# Altium schematic sheet communication.SchDoc
size A3
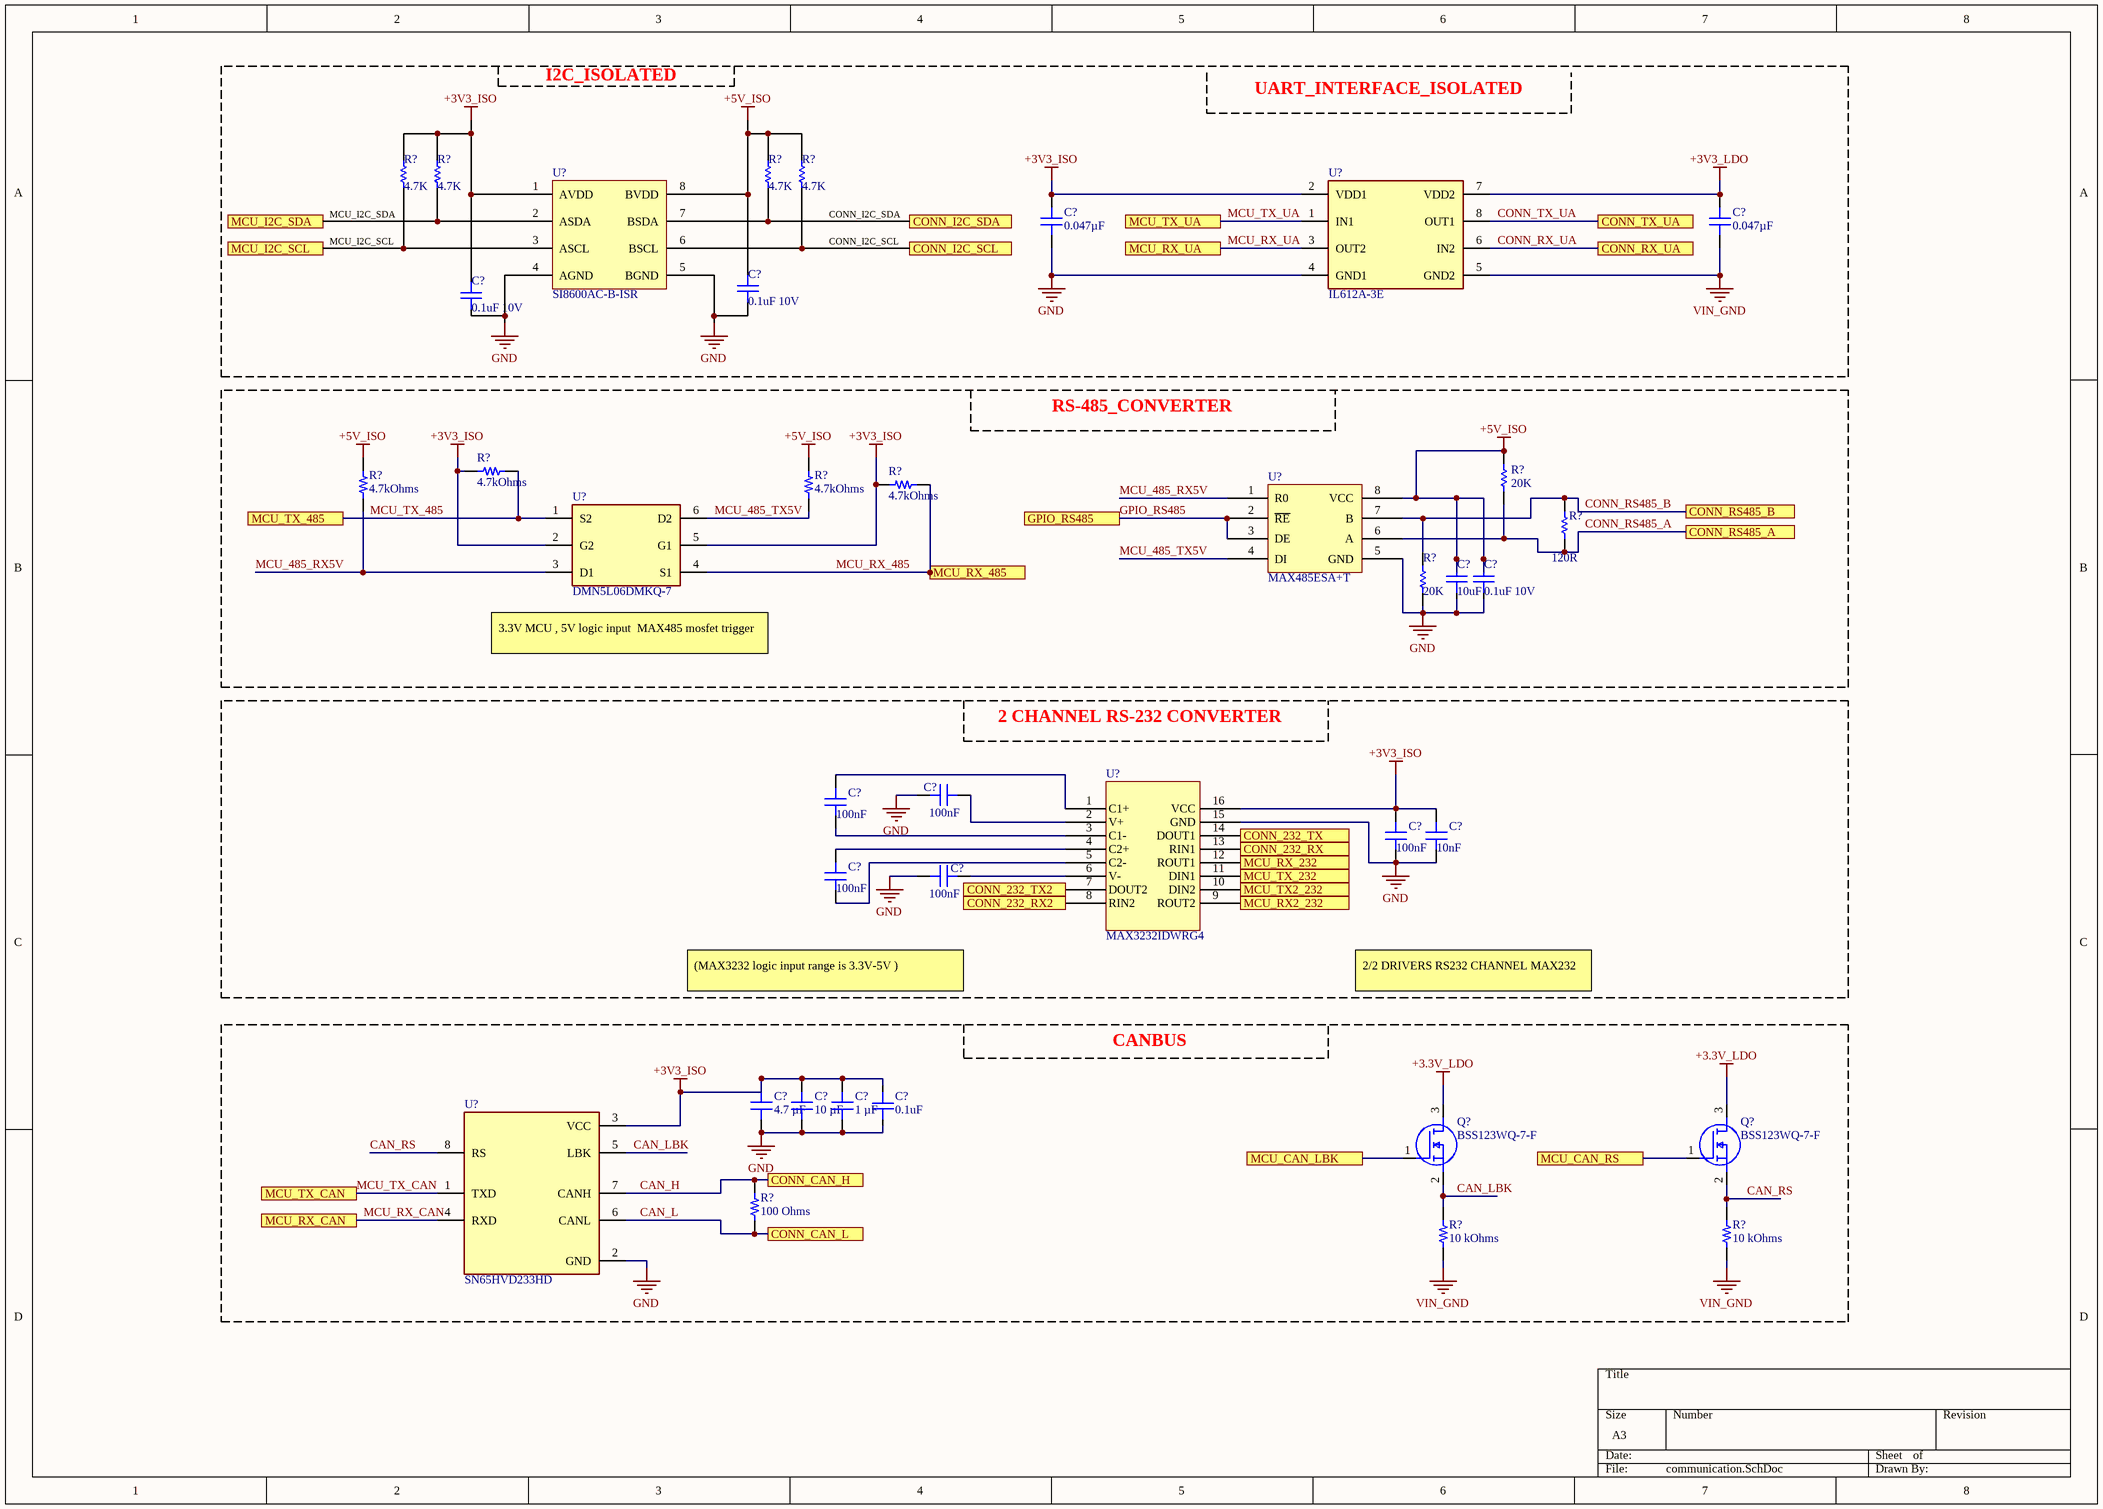
[diagram p0: communication.SchDoc]

## Parts
(Parts that share a designator on the sheet are numbered #1, #2 ... from top to bottom, then left to right.)
C?#1  0.047µF  [CAP 0603_1608]
C?#2  0.047µF  [CAP 0603_1608]
C?#3  0.1uF 10V  [C0603]
C?#4  0.1uF 10V  [C0603]
C?#5  10uF  [C1210]
C?#6  0.1uF 10V  [C0603]
C?#7  100nF  [CAP-0603]
C?#8  100nF  [CAP-0603]
C?#9  100nF  [CAP-0603]
C?#10  100nF  [CAP-0603]
C?#11  10nF  [CAP-0603]
C?#12  100nF  [CAP-0603]
C?#13  0.1uF  [C0603]
C?#14  4.7 µF  [CAP 0603_1608]
C?#15  10 µF  [CAP 0603_1608]
C?#16  1 µF  [CAP 0603_1608]
Q?#1  BSS123WQ-7-F  [SOT65P210X110-3N]
Q?#2  BSS123WQ-7-F  [SOT65P210X110-3N]
R?#1  4.7K  [R0805]
R?#2  4.7K  [R0805]
R?#3  4.7K  [R0805]
R?#4  4.7K  [R0805]
R?#5  4.7kOhms  [RES-0603]
R?#6  4.7kOhms  [RES-0603]
R?#7  20K  [R0805]
R?#8  4.7kOhms  [RES-0603]
R?#9  4.7kOhms  [RES-0603]
R?#10  120R  [R0805]
R?#11  20K  [R0805]
R?#12  100 Ohms  [RES 0603_1608]
R?#13  10 kOhms  [RES 0603_1608]
R?#14  10 kOhms  [RES 0603_1608]
U?#1  SI8600AC-B-ISR  [SOIC127P600X175-8N]
U?#2  IL612A-3E  [8-soic]
U?#3  MAX485ESA+T  [SOIC127P600X175-8N]
U?#4  DMN5L06DMKQ-7  [SOT-26]
U?#5  MAX3232IDWRG4  [SOIC-16]
U?#6  SN65HVD233HD  [8-soic]

## Blocks framed on the sheet
RS-485_CONVERTER: C?#5 C?#6 R?#5-R?#11 U?#3 U?#4
2 CHANNEL RS-232 CONVERTER: C?#7-C?#12 U?#5
CANBUS: C?#13-C?#16 Q?#1 Q?#2 R?#12-R?#14 U?#6

## Ports
CONN_232_RX, CONN_232_RX2, CONN_232_TX, CONN_232_TX2, CONN_CAN_H, CONN_CAN_L, CONN_I2C_SCL, CONN_I2C_SDA, CONN_RS485_A, CONN_RS485_B, CONN_RX_UA, CONN_TX_UA, GPIO_RS485, MCU_CAN_LBK, MCU_CAN_RS, MCU_I2C_SCL, MCU_I2C_SDA, MCU_RX2_232, MCU_RX_232, MCU_RX_485, MCU_RX_CAN, MCU_RX_UA, MCU_TX2_232, MCU_TX_232, MCU_TX_485, MCU_TX_CAN, MCU_TX_UA

## Nets
+3.3V_LDO: Q?#1.3(D) Q?#2.3(D)
+3V3_ISO: C?#1.2 C?#4.2 C?#10.2 C?#11.2 C?#13.1 C?#14.2 C?#15.2 C?#16.2 R?#1.2 R?#2.2 R?#5.2 R?#6.1 U?#1.1(AVDD) U?#2.2(VDD1) U?#4.2(G2) U?#4.5(G1) U?#5.16(VCC) U?#6.3(VCC)
+3V3_LDO: C?#2.2 U?#2.7(VDD2)
+5V_ISO: C?#3.2 C?#5.2 C?#6.2 R?#3.2 R?#4.2 R?#7.2 R?#8.2 R?#9.2 U?#1.8(BVDD) U?#3.8(VCC)
GND: C?#1.1 C?#3.1 C?#4.1 C?#5.1 C?#6.1 C?#8.2 C?#10.1 C?#11.1 C?#12.2 C?#13.2 C?#14.1 C?#15.1 C?#16.1 R?#11.1 U?#1.4(AGND) U?#1.5(BGND) U?#2.4(GND1) U?#3.5(GND) U?#5.15(GND) U?#6.2(GND)
VIN_GND: C?#2.1 R?#13.1 R?#14.1 U?#2.5(GND2)
CAN_H: R?#12.2 U?#6.7(CANH) ; port CONN_CAN_H
CAN_L: R?#12.1 U?#6.6(CANL) ; port CONN_CAN_L
CAN_LBK: Q?#1.2(S) R?#13.2 U?#6.5(LBK)
CAN_RS: Q?#2.2(S) R?#14.2 U?#6.8(RS)
CONN_232_RX: U?#5.13(RIN1) ; port CONN_232_RX
CONN_232_RX2: U?#5.8(RIN2) ; port CONN_232_RX2
CONN_232_TX: U?#5.14(DOUT1) ; port CONN_232_TX
CONN_232_TX2: U?#5.7(DOUT2) ; port CONN_232_TX2
CONN_I2C_SCL: R?#4.1 U?#1.6(BSCL) ; port CONN_I2C_SCL
CONN_I2C_SDA: R?#3.1 U?#1.7(BSDA) ; port CONN_I2C_SDA
CONN_RS485_A: R?#7.1 R?#10.1 U?#3.6(A) ; port CONN_RS485_A
CONN_RS485_B: R?#10.2 R?#11.2 U?#3.7(B) ; port CONN_RS485_B
CONN_RX_UA: U?#2.6(IN2) ; port CONN_RX_UA
CONN_TX_UA: U?#2.8(OUT1) ; port CONN_TX_UA
GPIO_RS485: U?#3.2(~{RE}) U?#3.3(DE) ; port GPIO_RS485
MCU_485_RX5V: R?#8.1 U?#3.1(R0) U?#4.3(D1)
MCU_485_TX5V: R?#9.1 U?#3.4(DI) U?#4.6(D2)
MCU_CAN_LBK: Q?#1.1(G) ; port MCU_CAN_LBK
MCU_CAN_RS: Q?#2.1(G) ; port MCU_CAN_RS
MCU_I2C_SCL: R?#1.1 U?#1.3(ASCL) ; port MCU_I2C_SCL
MCU_I2C_SDA: R?#2.1 U?#1.2(ASDA) ; port MCU_I2C_SDA
MCU_RX2_232: U?#5.9(ROUT2) ; port MCU_RX2_232
MCU_RX_232: U?#5.12(ROUT1) ; port MCU_RX_232
MCU_RX_485: R?#6.2 U?#4.4(S1) ; port MCU_RX_485
MCU_RX_CAN: U?#6.4(RXD) ; port MCU_RX_CAN
MCU_RX_UA: U?#2.3(OUT2) ; port MCU_RX_UA
MCU_TX2_232: U?#5.10(DIN2) ; port MCU_TX2_232
MCU_TX_232: U?#5.11(DIN1) ; port MCU_TX_232
MCU_TX_485: R?#5.1 U?#4.1(S2) ; port MCU_TX_485
MCU_TX_CAN: U?#6.1(TXD) ; port MCU_TX_CAN
MCU_TX_UA: U?#2.1(IN1) ; port MCU_TX_UA
NetC?#7_1: C?#7.1 U?#5.1(C1+)
NetC?#7_2: C?#7.2 U?#5.3(C1-)
NetC?#8_1: C?#8.1 U?#5.2(V+)
NetC?#9_1: C?#9.1 U?#5.4(C2+)
NetC?#9_2: C?#9.2 U?#5.5(C2-)
NetC?#12_1: C?#12.1 U?#5.6(V-)

## Notes on the sheet
- I2C_ISOLATED
- UART_INTERFACE_ISOLATED
- (near U?#4) 3.3V MCU , 5V logic input  MAX485 mosfet trigger
- (MAX3232 logic input range is 3.3V-5V )
- 2/2 DRIVERS RS232 CHANNEL MAX232

## Library data of the parts
C?#1 C?#2 = 0603YC473KAT2A: CAP CER 0.047UF 16V X7R 0603; manufacturer: AVX Corporation; Tolerance: ±10%; Part Number: 0603YC473KAT2A; Value: 0.047µF; Applications: General Purpose; Capacitance: 0.047µF; componentlink1description: Datasheet; componentlink1url: http://datasheets.avx.com/X7RDielectric.pdf; componentlink2description: DigiKey Link; componentlink2url: http://digikey.com/product-detail/en/avx-corporation/0603YC473KAT2A/478-5894-1-ND/2177826; Device Package: 0603 (1608 Metric); lastupdated: 2.09.2020 01:03:32; Lifecycle Status: Active; Minimum Order: 1; Mounting Type: Surface Mount, MLCC; Operating Temperature: -55°C ~ 125°C; Package / Case: 0603 (1608 Metric); packaging: TapeAndReel; partid: 4239; Part Status: Active; price: 0.02; series: -; Size / Dimension: 0.063" L x 0.032" W (1.60mm x 0.81mm); Supplier 1: DigiKey; Supplier Part Number 1: 478-5894-1-ND; Temperature Coefficient: X7R; Thickness (Max): 0.035" (0.90mm); Voltage - Rated: 16V
C?#3 C?#4 C?#6 = C0009: CAP CER 0.1UF 10V X7R 0603; Part Number: C0603C104K8RACTU; Manufacturer.: KEMET
C?#5 = C0016: CAP CER 10UF 25V X7R 1210; Part Number: C1210C106K3RACTU; Manufacturer.: KEMET
C?#7-C?#10 C?#12 = C0603C104K5RAC7411: Cap Ceramic 0.1uF 50V X7R 10% SMD 0603 125°C Paper T/R 100nF; Manufacturer: KEMET; Dissipation Factor: 2.5%; Supplier 1: Digi-Key; Manufacturer Part Number: C0603C104K5RAC7411; RoHS: Yes; Category: Ceramic Capacitors; Stock 1: 3300000; Pricing 1: 15000=0,01540, 30000=0,01463, 75000=0,01309, 105000=0,01059, 150000=0,01024, 375000=0,00963 (USD); Mount: Surface Mount; Case/Package: 0603; Case Code (Metric): 1608; Case Code (Imperial): 0603; Dielectric Material: Ceramic; Min Operating Temperature: -55°C; Max Operating Temperature: 125°C; Tolerance: 10%; Capacitance: 100nF; Dielectric: X7R; Voltage Rating (DC): 50V; Packaging: Tape and Reel; Package Quantity: 15000; Voltage Rating: 50V; Termination: SMD/SMT; Length: 1.6mm; Width: 0.031inch; Height: 0.8mm; Thickness: 0.035inch; Lead Pitch: 0.7mm; Depth: 0.8mm; Radiation Hardening: No; ComponentLink1URL: https://datasheet.ciiva.com/5424/kem-c1002-x7r-smd-5424426.pdf?src-supplier=Mouser; ComponentLink1Description: https://datasheet.ciiva.com/5424/kem-c1002-x7r-smd-5424426.pdf?src-supplier=Mouser; Supplier Part Number 1: 399-7374-2-ND
C?#11 = C0603C103M5RAC7411_1: Cap Ceramic 0.01uF 50V X7R 20% SMD 0603 125°C Paper T/R; Manufacturer: KEMET; Supplier 1: Digi-Key; Manufacturer Part Number: C0603C103M5RAC7411; RoHS: Yes; Category: Ceramic Capacitors; Stock 1: 336197; Pricing 1: 1=0,10000, 10=0,03000, 50=0,01640, 100=0,01350, 500=0,00962, 1000=0,00756, 2500=0,00688, 5000=0,00632 (USD); Mount: Surface Mount; Case/Package: 0603; Case Code (Imperial): 0603; Case Code (Metric): 1608; Contact Plating: Tin,Matte; Dielectric Material: Ceramic; Min Operating Temperature: -55°C; Max Operating Temperature: 125°C; Packaging: Tape and Reel; Package Quantity: 50000; Tolerance: 20%; Voltage Rating: 50V; Voltage Rating (DC): 50V; Capacitance: 10nF; Dielectric: X7R; Termination: SMD/SMT; Series: C0603C; Construction: Flat; Length: 1.6mm; Height: 0.8mm; Lead Pitch: 0.7mm; Depth: 0.8mm; Radiation Hardening: No; RoHS Compliant: Yes; ComponentLink1URL: http://www.mouser.com/ds/2/212/KEM_C1002_X7R_SMD-1102033.pdf?src-supplier=Mouser; ComponentLink1Description: http://www.mouser.com/ds/2/212/KEM_C1002_X7R_SMD-1102033.pdf?src-supplier=Mouser; ComponentLink2URL: http://capacitoredge.kemet.com/capedge2/DataSheet?pn=C0603C103M5RAC7411&src-supplier=Avnet; ComponentLink2Description: http://capacitoredge.kemet.com/capedge2/DataSheet?pn=C0603C103M5RAC7411&src-supplier=Avnet; Supplier Part Number 1: 399-C0603C103M5RAC7411CT-ND
C?#13 = C0001: CAP CER 0.1UF 50V X7R 0603; Manufacturer.: KEMET; Part Number: C0603C104K5RACTU
C?#14 = CL10A475KA8NQNC: CAP CER 4.7UF 25V X5R 0603; manufacturer: Samsung Electro-Mechanics; Tolerance: ±10%; Part Number: CL10A475KA8NQNC; Value: 4.7 µF; Applications: General Purpose; Capacitance: 4.7 µF; componentlink1description: Datasheet; componentlink1url: http://www.samsungsem.com/kr/support/product-search/mlcc/CL10A475KA8NQNC.jsp; componentlink2description: DigiKey Link; componentlink2url: https://www.digikey.com/en/products/detail/samsung-electro-mechanics/CL10A475KA8NQNC/3887558; Device Package: 0603 (1608 Metric); lastupdated: 12.05.2022 14:08:21; Lifecycle Status: Active; Minimum Order: 1; Mounting Type: Surface Mount, MLCC; Operating Temperature: -55°C ~ 85°C; Package / Case: 0603 (1608 Metric); packaging: TapeAndReel; partid: 2349; Part Status: Active; price: 0.06; series: CL; Size / Dimension: 0.063" L x 0.031" W (1.60mm x 0.80mm); Supplier 1: DigiKey; Supplier Part Number 1: 1276-1900-1-ND; Temperature Coefficient: X5R; Thickness (Max): 0.035" (0.90mm); Voltage - Rated: 25V
C?#15 = GRT188R61C106ME13D: CAP CER 10UF 16V X5R 0603; manufacturer: Murata Electronics; Tolerance: ±20%; Part Number: GRT188R61C106ME13D; Value: 10 µF; Applications: Automotive; Capacitance: 10 µF; componentlink1description: Datasheet; componentlink1url: https://search.murata.co.jp/Ceramy/image/img/A01X/G101/ENG/GRT188R61C106ME13-01.pdf; componentlink2description: DigiKey Link; componentlink2url: https://www.digikey.com/en/products/detail/murata-electronics/GRT188R61C106ME13D/5416740; Device Package: 0603 (1608 Metric); lastupdated: 12.05.2022 14:08:21; Lifecycle Status: Active; Minimum Order: 1; Mounting Type: Surface Mount, MLCC; Operating Temperature: -55°C ~ 85°C; Package / Case: 0603 (1608 Metric); packaging: TapeAndReel; partid: 2515; Part Status: Active; price: 0.07; Ratings: AEC-Q200; series: GRT; Size / Dimension: 0.063" L x 0.031" W (1.60mm x 0.80mm); Supplier 1: DigiKey; Supplier Part Number 1: 490-12318-1-ND; Temperature Coefficient: X5R; Thickness (Max): 0.035" (0.90mm); Voltage - Rated: 16V
C?#16 = TMK107BJ105MAHT: CAP CER 1UF 25V X5R 0603; manufacturer: Taiyo Yuden; Tolerance: ±20%; Part Number: TMK107BJ105MAHT; Value: 1 µF; Applications: Automotive, SMPS Filtering; Capacitance: 1 µF; componentlink1description: Datasheet; componentlink1url: https://ds.yuden.co.jp/TYCOMPAS/ut/detail?pn=TMK107BJ105MAHT &u=M; componentlink2description: DigiKey Link; componentlink2url: https://www.digikey.com/en/products/detail/taiyo-yuden/TMK107BJ105MAHT/6563148; Device Package: 0603 (1608 Metric); Features: Ultra Low ESR; lastupdated: 12.05.2022 14:08:20; Lifecycle Status: Active; Minimum Order: 1; Mounting Type: Surface Mount, MLCC; Operating Temperature: -55°C ~ 85°C; Package / Case: 0603 (1608 Metric); packaging: TapeAndReel; partid: 2797; Part Status: Active; price: 0.02; Ratings: AEC-Q200; series: M; Size / Dimension: 0.063" L x 0.031" W (1.60mm x 0.80mm); Supplier 1: DigiKey; Supplier Part Number 1: 587-6356-1-ND; Temperature Coefficient: X5R; Thickness (Max): 0.035" (0.90mm); Voltage - Rated: 25V
Q?#1 Q?#2 = BSS123WQ-7-F: MOSFET (N-Channel); Manufacturer_Name: Diodes Inc.; Datasheet Link: https://labcenter.componentsearchengine.com/Datasheets/2/BSS123WQ-7-F.pdf; Height: 1.1mm; Manufacturer_Part_Number: BSS123WQ-7-F; Mouser Part Number: 621-BSS123WQ-7-F; Mouser Price/Stock: https://www.mouser.co.uk/ProductDetail/Diodes-Incorporated/BSS123WQ-7-F?qs=GSeC4G%252BEqEX8zUQUKMJ7Eg%3D%3D; Arrow Part Number: BSS123WQ-7-F; Arrow Price/Stock: https://www.arrow.com/en/products/bss123wq-7-f/diodes-incorporated
R?#1-R?#4 = R0013: RES SMD 4.7K OHM 1% 1/8W 0805; Manufacturer.: Panasonic Electronic Components; Part Number: ERJ-6ENF4701V
R?#5 R?#6 R?#8 R?#9 = RC0603FR-074K7L: 4.7 kOhms ±1% 0.1W, 1/10W Chip Resistor 0603 (1608 Metric) Moisture Resistant Thick Film; Manufacturer: Yageo; Manufacturer Part Number: RC0603FR-0710KL; Resistance: 10kR; Temperature Coefficient: 100ppm/°C; Voltage Rating (DC): 50V; Power Rating: 100mW; Voltage Rating: 75V; Supplier 1: Digi-Key; RoHS: Yes; Category: Chip SMD Resistors; Stock 1: 28996893; Pricing 1: 1=0,10000, 10=0,02400, 100=0,00970, 1000=0,00436, 2500=0,00378 (USD); Case/Package: 0603; Number of Pins: 2; Case Code (Imperial): 0603; Case Code (Metric): 1608; Weight: 7.1E-05oz; Size Code: 0603; Min Operating Temperature: -55°C; Max Operating Temperature: 155°C; Tolerance: 1%; Resistor Type: Thick Film; Packaging: Tape and Reel; Termination: SMD/SMT; Features: Moisture Resistant; Series: RC; Max Power Dissipation: 100mW; Number of Terminations: 2; Resistance Tolerance: 1%; Construction: Rectangular; Length: 1.6mm; Width: 0.8mm; Height: 0.45mm; Depth: 0.8mm; Lead Pitch: 0.3mm; REACH SVHC: Unknown; Lead Free: Lead Free; Military Standard: Not; RoHS Compliant: Yes; ComponentLink1URL: https://datasheet.ciiva.com/7660/38590-7660789.pdf?src-supplier=Element14; ComponentLink1Description: https://datasheet.ciiva.com/7660/38590-7660789.pdf?src-supplier=Element14; ComponentLink2URL: https://datasheet.ciiva.com/7983/443971-7983596.pdf?src-supplier=Element14; ComponentLink2Description: https://datasheet.ciiva.com/7983/443971-7983596.pdf?src-supplier=Element14; ComponentLink3URL: https://datasheet.ciiva.com/22747/443971-22747519.pdf?src-supplier=Element14; ComponentLink3Description: https://datasheet.ciiva.com/22747/443971-22747519.pdf?src-supplier=Element14; ComponentLink4URL: https://datasheet.ciiva.com/46440/1868787-46440891.pdf?src-supplier=Element14; ComponentLink4Description: https://datasheet.ciiva.com/46440/1868787-46440891.pdf?src-supplier=Element14; ComponentLink5URL: https://datasheet.ciiva.com/7746/1738695-7746239.pdf?src-supplier=Element14; ComponentLink5Description: https://datasheet.ciiva.com/7746/1738695-7746239.pdf?src-supplier=Element14; ComponentLink6URL: https://datasheet.ciiva.com/15189/getdatasheetpartid-409289-15189591.pdf?src-supplier=Verical; ComponentLink6Description: https://datasheet.ciiva.com/15189/getdatasheetpartid-409289-15189591.pdf?src-supplier=Verical; Supplier Part Number 1: 311-10.0KHRCT-ND; Supplier 2: Digi-Key; Stock 2: 20570870; Pricing 2: 1=0,10000, 10=0,02400, 100=0,00970, 1000=0,00436, 2500=0,00378 (USD); ComponentLink7URL: https://datasheet.ciiva.com/15189/getdatasheetpartid-422754-15189760.pdf?src-supplier=Verical; ComponentLink7Description: https://datasheet.ciiva.com/15189/getdatasheetpartid-422754-15189760.pdf?src-supplier=Verical; ComponentLink8URL: https://datasheet.ciiva.com/7660/38590-7660794.pdf?src-supplier=Element14; ComponentLink8Description: https://datasheet.ciiva.com/7660/38590-7660794.pdf?src-supplier=Element14; ComponentLink9URL: https://datasheet.ciiva.com/22747/443971-22747528.pdf?src-supplier=Element14; ComponentLink9Description: https://datasheet.ciiva.com/22747/443971-22747528.pdf?src-supplier=Element14; ComponentLink10URL: https://datasheet.ciiva.com/46440/1868787-46440909.pdf?src-supplier=Element14; ComponentLink10Description: https://datasheet.ciiva.com/46440/1868787-46440909.pdf?src-supplier=Element14; ComponentLink11URL: https://datasheet.ciiva.com/7746/1868787-7746365.pdf?src-supplier=Element14; ComponentLink11Description: https://datasheet.ciiva.com/7746/1868787-7746365.pdf?src-supplier=Element14; ComponentLink12URL: https://datasheet.ciiva.com/7746/1738695-7746366.pdf?src-supplier=Element14; ComponentLink12Description: https://datasheet.ciiva.com/7746/1738695-7746366.pdf?src-supplier=Element14; Supplier Part Number 2: 311-4.70KHRCT-ND
R?#7 R?#11 = R0022: RES SMD 20K OHM 1% 1/8W 0805; Part Number: ERJ-6ENF2002V; Manufacturer.: Panasonic Electronic Components
R?#10 = R0014: RES SMD 120 OHM 1% 1/8W 0805; Manufacturer.: Panasonic Electronic Components; Part Number: ERJ-6ENF1200V
R?#12 = PEP0603Y1000BGTA: PEP0603 10PPM/C 100R 0.1% G TA; Manufacturer: Vishay Sfernice; Power (Watts): 0.32W; Temperature Coefficient: ±10ppm/°C; Part Number: PEP0603Y1000BGTA; Value: 100 Ohms; ComponentLink1Description: Datasheet; ComponentLink1URL: https://www.vishay.com/docs/53083/pep.pdf; ComponentLink2Description: DigiKey Link; ComponentLink2URL: https://www.digikey.com/en/products/detail/vishay-sfernice/PEP0603Y1000BGTA/15777713; Composition: Thin Film; Device Package: 0603 (1608 Metric); Features: Anti-Sulfur; Height - Seated (Max): 0.018" (0.45mm); LastUpdated: 12.05.2022 14:25:31; Lifecycle Status: Active; Minimum Order: 1; Number of Terminations: 2; Operating Temperature: -55°C ~ 155°C; Package / Case: 0603 (1608 Metric); Packaging: TapeAndReel; PartId: 62030; Part Status: Active; Price: 5.75; Resistance: 100 Ohms; Series: PEP; Size / Dimension: 0.060" L x 0.033" W (1.52mm x 0.85mm); Supplier 1: DigiKey; Supplier Part Number 1: 716-PEP0603Y1000BGTACT-ND; Supplier Device Package: 0603; Tolerance: ±0.1%
R?#13 R?#14 = RCC060310K0FKEA: RCC0603 100 10K 1% ET1 E3; Manufacturer: Vishay Dale; Power (Watts): 0.2W, 1/5W; Temperature Coefficient: ±100ppm/°C; Part Number: RCC060310K0FKEA; Value: 10 kOhms; ComponentLink1Description: Datasheet; ComponentLink1URL: https://www.vishay.com/docs/20066/rcce3.pdf; ComponentLink2Description: DigiKey Link; ComponentLink2URL: https://www.digikey.com/en/products/detail/vishay-dale/RCC060310K0FKEA/12084233; Composition: Thick Film; Device Package: 0603 (1608 Metric); Features: Automotive AEC-Q200; Height - Seated (Max): 0.020" (0.50mm); LastUpdated: 12.05.2022 14:25:26; Lifecycle Status: Active; Minimum Order: 1; Number of Terminations: 2; Operating Temperature: -55°C ~ 155°C; Package / Case: 0603 (1608 Metric); Packaging: TapeAndReel; PartId: 67022; Part Status: Active; Price: 0.01; Ratings: AEC-Q200; Resistance: 10 kOhms; Series: RCC e3; Size / Dimension: 0.061" L x 0.033" W (1.55mm x 0.85mm); Supplier 1: DigiKey; Supplier Part Number 1: 541-RCC060310K0FKEACT-ND; Supplier Device Package: 0603; Tolerance: ±1%
U?#1 = U0021: Bidirectional I2C Isolators with Unidirectional Digital Channels; Manufacturer.: Skyworks Solutions Inc; Part Number: SI8600AC-B-ISR
U?#2 = IL612A-3E: 2-Channel Passive Input, Open-Drain Isolator, 2.5 kV, SOIC8,; MF: NVE; Purchase-URL: https://pricing.snapeda.com/search/part/IL612A-3E/?ref=eda; Check_prices: https://www.snapeda.com/parts/IL612A-3E/NVE/view-part/?ref=eda; Package: SOIC-8 NVE; SnapEDA_Link: https://www.snapeda.com/parts/IL612A-3E/NVE/view-part/?ref=snap; Value: *; MP: IL612A-3E; Digi-Key_Part_Number: 390-IL612A-3E-ND
U?#3 = U0017: 1/1 Transceiver Half RS422, RS485 8-SOIC; Manufacturer.: Maxim Integrated; Part Number: MAX485ESA+T
U?#4 = DMN5L06DMKQ-7: Transistor MOSFET Array Dual N-CH 50V 305mA 6-Pin SOT-26 T/R; Manufacturer: Diodes; MP: TS19720CX6 RFG; MF: Taiwan Semiconductor; Rds On Max: 2R; Input Capacitance: 50pF; Max Power Dissipation: 400mW; FET Type: 2 N-Channel; Availability: In Stock; Package: SOT-26 Taiwan Semiconductor; Check_prices: https://www.snapeda.com/parts/TS19720CX6%20RFG/Taiwan+Semiconductor/view-part/?ref=eda; Price: None; SnapEDA_Link: https://www.snapeda.com/parts/TS19720CX6%20RFG/Taiwan+Semiconductor/view-part/?ref=snap; Value: *; Purchase-URL: https://pricing.snapeda.com/search/part/TS19720CX6 RFG/?ref=eda; Supplier 1: Digi-Key; Manufacturer Part Number: DMN5L06DMKQ-7; RoHS: Yes; Category: MOSFETs; Stock 1: 50; Pricing 1: 1=0,56000, 10=0,47600, 100=0,35570, 500=0,27952, 1000=0,21598 (USD); Mount: Surface Mount; Case/Package: SOT-23-6; Min Operating Temperature: -65°C; Max Operating Temperature: 150°C; Packaging: Tape and Reel; Drain to Source Voltage (Vdss): 50V; Continuous Drain Current (ID): 305mA; RoHS Compliant: Yes; ComponentLink1URL: http://www.mouser.com/ds/2/115/ds30927-709407.pdf?src-supplier=Mouser; ComponentLink1Description: http://www.mouser.com/ds/2/115/ds30927-709407.pdf?src-supplier=Mouser; ComponentLink2URL: https://www.diodes.com/assets/Datasheets/DMN5L06DMKQ.pdf?src-supplier=Digi-Key; ComponentLink2Description: https://www.diodes.com/assets/Datasheets/DMN5L06DMKQ.pdf?src-supplier=Digi-Key; Supplier Part Number 1: DMN5L06DMKQ-7DICT-ND
U?#5 = MAX3232IDWRG4: IC Transceiver Full 2/2 16SOIC; Manufacturer: Texas Instruments; Nominal Supply Current: 1mA; Data Rate: 250Kbps; Number of Receivers: 2; Max Supply Voltage: 5.5V; Min Supply Voltage: 3V; Logic Function: Transceiver,Receiver; Number of Transceivers: 1; Operating Supply Voltage: 5V; Supplier 1: Digi-Key; Manufacturer Part Number: MAX3232IDWRG4; RoHS: Yes; Category: RS-232 / RS-422 / RS-485 Interface ICs; Pricing 1: 2000=1,32825 (USD); Mount: Surface Mount; Case/Package: SOIC; Number of Pins: 16; Weight: 0.014829oz; Min Operating Temperature: -40°C; Max Operating Temperature: 85°C; Package Quantity: 2000; Packaging: Tape and Reel; Number of Transmitters: 2; Number of Drivers: 2; Series: -; Supply Current: 1mA; Lead Free: Lead Free; RoHS Compliant: Yes; ComponentLink1URL: https://datasheet.ciiva.com/1770/max3232-1770641.pdf?src-supplier=Digi-Key; ComponentLink1Description: https://datasheet.ciiva.com/1770/max3232-1770641.pdf?src-supplier=Digi-Key
U?#6 = SN65HVD233HD: 1/1 Transceiver Half CANbus 8-SOIC; Package: None; Price: None; Value: *; MP: SN65HVD233HD; Availability: Unavailable